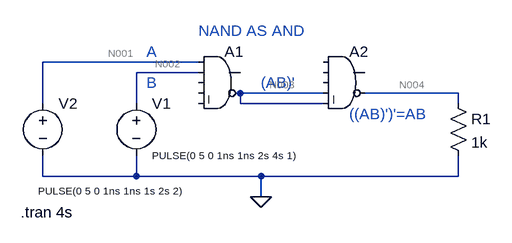
[diagram p0: schematic 202.asc]
202.asc, the LTspice schematic file:
Version 4
SHEET 1 880 680
WIRE 208 32 -32 32
WIRE 208 48 112 48
WIRE 400 80 272 80
WIRE 608 80 464 80
WIRE -32 96 -32 32
WIRE 112 96 112 48
WIRE 272 96 272 80
WIRE 400 96 272 96
WIRE 608 96 608 80
WIRE -32 208 -32 176
WIRE 112 208 112 176
WIRE 112 208 -32 208
WIRE 304 208 112 208
WIRE 608 208 608 176
WIRE 608 208 304 208
WIRE 304 240 304 208
FLAG 304 240 0
SYMBOL Digital\\and 240 0 R0
SYMATTR InstName A1
SYMBOL Digital\\and 432 0 R0
SYMATTR InstName A2
SYMBOL res 592 80 R0
SYMATTR InstName R1
SYMATTR Value 1k
SYMBOL voltage 112 80 R0
WINDOW 3 24 96 Left 1
WINDOW 123 0 0 Left 0
WINDOW 39 0 0 Left 0
SYMATTR InstName V1
SYMATTR Value PULSE(0 5 0 1ns 1ns 2s 4s 1)
SYMBOL voltage -32 80 R0
WINDOW 3 -7 151 Left 1
WINDOW 123 0 0 Left 0
WINDOW 39 0 0 Left 0
SYMATTR InstName V2
SYMATTR Value PULSE(0 5 0 1ns 1ns 1s 2s 2)
TEXT 208 -16 Left 2 ;NAND AS AND
TEXT 128 16 Left 2 ;A
TEXT 128 64 Left 2 ;B
TEXT 304 64 Left 2 ;(AB)'
TEXT 440 112 Left 2 ;((AB)')'=AB
TEXT -66 264 Left 2 !.tran 4s

The netlist it stands for:
* 202.asc
A1 N001 N002 0 0 0 N003 0 0 AND
A2 0 0 0 N003 N003 N004 0 0 AND
R1 N004 0 1k
V1 N002 0 PULSE(0 5 0 1ns 1ns 2s 4s 1)
V2 N001 0 PULSE(0 5 0 1ns 1ns 1s 2s 2)
* NAND AS AND
* A
* B
* (AB)'
* ((AB)')'=AB
.tran 4s
.backanno
.end

* Results of the author's LTspice run, read from the files saved beside the schematic
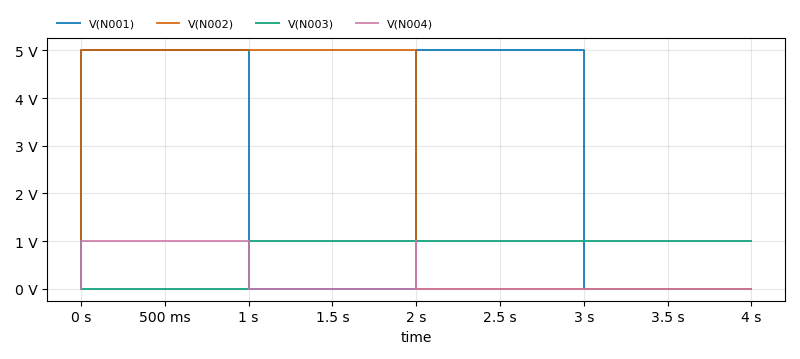
[diagram p1: Transient Analysis of 202.asc, plotted from the saved traces]
* Transient Analysis, 1 run:
*   V(N001): min 0 V, max 5 V, average 2.5 V, rms 3.536 V, last 0 V
*   V(N002): min 0 V, max 5 V, average 2.5 V, rms 3.536 V, last 0 V
*   V(N003): min 0 V, max 1 V, average 750 mV, rms 866 mV, last 1 V
*   V(N004): min 0 V, max 999 mV, average 249.8 mV, rms 499.5 mV, last 0 V